# Altium project LuminOX to SDI-12 Interface.PrjPcb
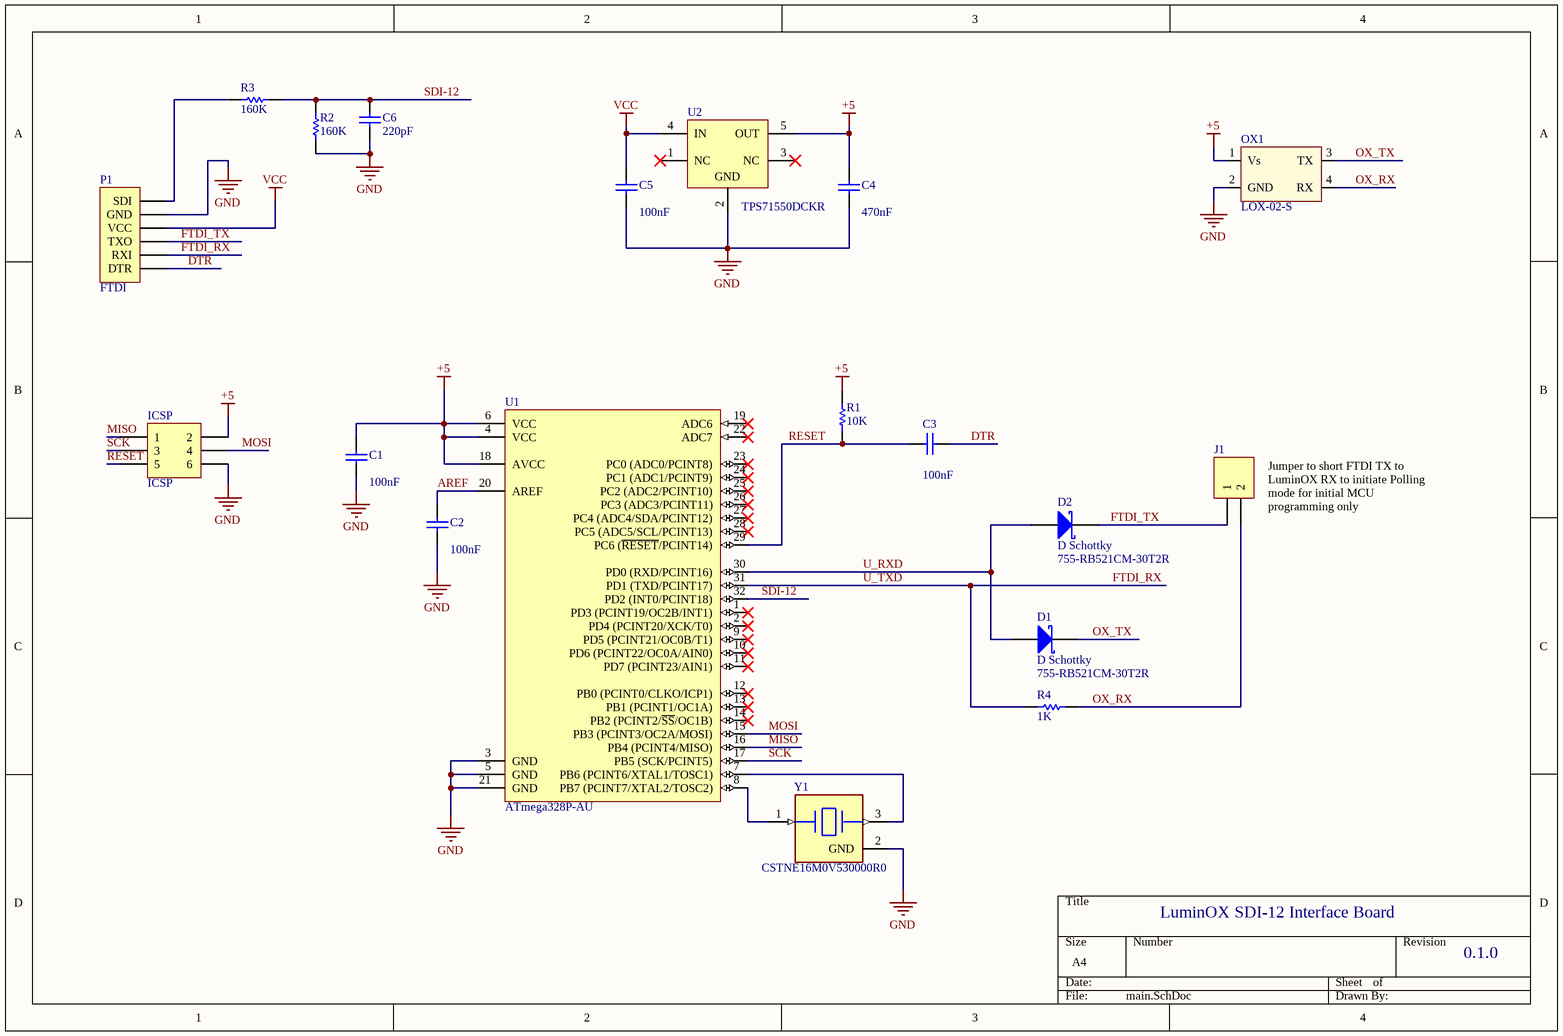
[diagram p0: main.SchDoc]
_version_major: 0; _version_minor: 1; _version_patch: 0
1 sheet, 19 parts. Net scope: global (net labels, ports and power ports of the same name join across sheets).
Board file: main.PcbDoc

## Sheet main.SchDoc
size A4; SheetNumber: 1; SheetTotal: 1

### Parts
C1  100nF  [C0402_CAPC1005X06N]
C2  100nF  [C0402_CAPC1005X06N]
C3  100nF  [C0402_CAPC1005X06N]
C4  470nF  [C0402_CAPC1005X06N]
C5  100nF  [C0402_CAPC1005X06N]
C6  220pF  [C0402_CAPC1005X06N]
D1  D Schottky  Supplier Part Number 1: 755-RB521CM-30T2R  [SOD923_SODFL98X40-2N]
D2  D Schottky  Supplier Part Number 1: 755-RB521CM-30T2R  [SOD923_SODFL98X40-2N]
ICSP  ICSP  [HDR2X3]
J1  (no value)  [HDR1X2]
OX1  LOX-02-S  [LOX-02-S]
P1  FTDI  [HDR1X6]
R1  10K  [R0402-RESC1005X04N]
R2  160K  [R0402-RESC1005X04N]
R3  160K  [R0402-RESC1005X04N]
R4  1K  [R0402-RESC1005X04N]
U1  ATmega328P-AU  [32A_M]
U2  TPS71550DCKR  [DCK0005A_N]
Y1  CSTNE16M0V530000R0  [FP-CSTNE16M0V530000R0-MFG]

### Nets
+5: C1.2 C4.2 ICSP.2 OX1.1(Vs) R1.2 U1.4(VCC) U1.6(VCC) U1.18(AVCC) U2.5(OUT)
GND: C1.1 C2.1 C4.1 C5.1 C6.2 ICSP.6 OX1.2(GND) P1.2(GND) R2.1 U1.3(GND) U1.5(GND) U1.21(GND) U2.2(GND) Y1.2(GND)
VCC: C5.2 P1.3(VCC) U2.4(IN)
AREF: C2.2 U1.20(AREF)
DTR: C3.1 P1.6(DTR)
FTDI_RX: P1.5(RXI) R4.1 U1.31(PD1_(TXD/PCINT17))  [also labelled U_TXD]
FTDI_TX: D2.2(K) J1.1 P1.4(TXO)
MISO: ICSP.1 U1.16(PB4_(PCINT4/MISO))
MOSI: ICSP.4 U1.15(PB3_(PCINT3/OC2A/MOSI))
OX_RX: J1.2 OX1.4(RX) R4.2
OX_TX: D1.2(K) OX1.3(TX)
RESET: C3.2 ICSP.5 R1.1 U1.29(PC6_(~{RESET}/PCINT14))
SCK: ICSP.3 U1.17(PB5_(SCK/PCINT5))
SDI-12: C6.1 R2.2 R3.1 U1.32(PD2_(INT0/PCINT18))
U_RXD: D1.1(A) D2.1(A) U1.30(PD0_(RXD/PCINT16))
NetP1_1: P1.1(SDI) R3.2
NetU1_7: U1.7(PB6_(PCINT6/XTAL1/TOSC1)) Y1.3(Output)
NetU1_8: U1.8(PB7_(PCINT7/XTAL2/TOSC2)) Y1.1(Input)

Not connected (* = marked no-connect by the designer): U1 1(PD3_(PCINT19/OC2B/INT1))* 2(PD4_(PCINT20/XCK/T0))* 9(PD5_(PCINT21/OC0B/T1))* 10(PD6_(PCINT22/OC0A/AIN0))* 11(PD7_(PCINT23/AIN1))* 12(PB0_(PCINT0/CLKO/ICP1))* 13(PB1_(PCINT1/OC1A))* 14(PB2_(PCINT2/~{SS}/OC1B))* 19(ADC6)* 22(ADC7)* 23(PC0_(ADC0/PCINT8))* 24(PC1_(ADC1/PCINT9))* 25(PC2_(ADC2/PCINT10))* 26(PC3_(ADC3/PCINT11))* 27(PC4_(ADC4/SDA/PCINT12))* 28(PC5_(ADC5/SCL/PCINT13))*; U2 1(NC)* 3(NC)*

### Notes on the sheet
- (near J1) Jumper to short FTDI TX to LuminOX RX to initiate Polling mode for initial MCU programming only
- LuminOX SDI-12 Interface Board

### Library data of the parts
C1-C6 = Cap Semi: Capacitor (Semiconductor SIM Model); Published: 8-Jun-2000; LatestRevisionDate: 29-May-2009; LatestRevisionNote: IPC-7351 Footprint Added.; PackageReference: C1206; Publisher: Altium Limited; PackageDescription: Chip Capacitor
  C1-C3 C5: Value: 100nF
  C4: Value: 470nF
  C6: Value: 220pF
D1 D2 = D Schottky: DIODESCHOTTKY30V100MAVMN2M; Manufacturer: Rohm; Manufacturer Part Number: RB521CM-30T2R; Average Rectified Current: 100mA; Max Reverse Voltage (DC): 30V; Published: 8-Jun-2000; LatestRevisionDate: 17-Jul-2002; LatestRevisionNote: Re-released for DXP Platform.; PackageReference: SMB; Publisher: Altium Limited; PackageDescription: DO-214-AA/SMB; 2 C-Bend Leads; Body 5.3 x 3.6 mm, inc. leads (LxW); Code_JEDEC: DO-214-AA; Supplier 1: Mouser; RoHS: Yes; Category: Rectifier Diodes; Stock 1: 103883; Pricing 1: 1=0.2, 10=0.143, 50=0.143, 100=0.087, 1000=0.062, 10000=0.04 (USD); Mount: Surface Mount; Case/Package: SMD/SMT; Number of Pins: 2; Packaging: Cut Tape; Series: -; RoHS Compliant: Yes; ComponentLink1URL: http://www.mouser.com/ds/2/348/rb521cm-30-e-907574.pdf?src-supplier=Mouser; ComponentLink1Description: http://www.mouser.com/ds/2/348/rb521cm-30-e-907574.pdf?src-supplier=Mouser; ComponentLink2URL: http://www.farnell.com/datasheets/2644371.pdf?src-supplier=Farnell; ComponentLink2Description: http://www.farnell.com/datasheets/2644371.pdf?src-supplier=Farnell; ComponentLink3URL: http://www.rohm.com/web/global/datasheet/RB521CM-30/rb521cm-30t2r-e?src-supplier=Digikey; ComponentLink3Description: http://www.rohm.com/web/global/datasheet/RB521CM-30/rb521cm-30t2r-e?src-supplier=Digikey; ComponentLink4URL: http://www.farnell.com/datasheets/2644371.pdf?src-supplier=Newark; ComponentLink4Description: http://www.farnell.com/datasheets/2644371.pdf?src-supplier=Newark; ComponentLink5URL: https://www.rohm.com/datasheet/RB521CM-30/rb521cm-30t2r-e?src-supplier=Digikey; ComponentLink5Description: https://www.rohm.com/datasheet/RB521CM-30/rb521cm-30t2r-e?src-supplier=Digikey
ICSP = Header 3X2: Header, 3-Pin, Dual row; LatestRevisionDate: 17-Jul-2002; LatestRevisionNote: Re-released for DXP Platform.; Publisher: Altium Limited
J1 = Header 2: Jumper to short FTDI TX to LuminOX RX to initiate Polling mode for initial MCU programming; LatestRevisionDate: 17-Jul-2002; LatestRevisionNote: Re-released for DXP Platform.; Publisher: Altium Limited
OX1 = LOX-02-S: LuminOx optical oxygen sensor; range: 25%; supply: 4.5-5.5VDC; working temperature: -30+60 deg.C; response time: 30s;...; Manufacturer: SST Sensing; Supplier 1: Mouser; Manufacturer Part Number: LOX-02-S; Stock 1: 5; Pricing 1: 1=138.36, 10=120.95, 50=115.92, 100=115.92, 1000=115.92, 10000=115.92 (USD)
P1 = Header 6: Header, 6-Pin; LatestRevisionDate: 17-Jul-2002; LatestRevisionNote: Re-released for DXP Platform.; Publisher: Altium Limited
R1-R4 = Res Semi: Semiconductor Resistor; Published: 8-Jun-2000; LatestRevisionDate: 17-Jul-2002; LatestRevisionNote: Re-released for DXP Platform.; PackageReference: AXIAL-0.5; Publisher: Altium Limited; PackageDescription: Axial Device, Thru-Hole; 2 Leads; 0.5 in Pin Spacing
  R1: Value: 10K
  R2 R3: Value: 160K
  R4: Value: 1K
U1 = CMP-0095-00269-2: 8-bit AVR Microcontroller, 32KB Flash, 1KB EEPROM, 2KB SRAM, 32-pin TQFP, Industrial Grade (-40°C to 85°C); PackageDescription: 32-Lead, 7x7x1.0 mm Body, 0.8mm Lead Pitch, Thin Profile Plastic Quad Flat Package (TQFP); DatasheetVersion: revD, May-2011; RevisionNote: DatasheetVersion & PackageVersion updated. URLs added.; ComponentLink1URL: http://www.atmel.com/; ComponentLink2Description: ATmega48A/48PA/88A/88PA/168A/168PA/328/328P Datasheet; Code_JEDEC: MS-026-ABA; ComponentLink1Description: Manufacturer URL; PackageReference: 32A; ComponentLink3Description: ATmega48A/48PA/88A/88PA/168A/168PA/328/328P Summary; ComponentLink2URL: http://www.atmel.com/dyn/resources/prod_documents/doc8271.pdf; PackageVersion: revC, Oct-2010; ComponentLink3URL: http://www.atmel.com/dyn/resources/prod_documents/8271S.pdf
U2 = CMP-0394-00921-2: Single Output LDO, 50 mA, Fixed 5 V Output, 3 to 24 V Input, 5-pin SC70 (DCK), -40 to 85 degC, Green (RoHS & no Sb/Br); Manufacturer: Texas Instruments; Iq(Typ)(mA): 0.003; Vout Adj(Min)(V): 5; SubFamily: Single Channel LDO; Vin(Min)(V): 3; Iout(Max)(A): 0.05; Vdo(Typ)(mV): 415; Accuracy(%): 4; Vin(Max)(V): 24; PartNumber: TPS71550DCKR; Eco-Plan: Green (RoHS & no Sb/Br); ComponentLink1URL: http://www.ti.com/; PackageDescription: 5-Pin Plastic Small-Outline, Body 2 x 1.25 mm, Pitch 0.65 mm; ComponentLink3URL: http://www.ti.com/litv/pdf/mpds025f; Mounting Technology: Surface Mount; ComponentLink3Description: Package Specification; PackageVersion: 4093553-3/G; Vout Adj(Max)(V): 5; ComponentLink2URL: http://www.ti.com/general/docs/lit/getliterature.tsp?genericPartNumber=TPS71550&fileType=pdf; DatasheetVersion: SLVS338P; ComponentLink2Description: Datasheet; Code_JEDEC: MO-203; ComponentLink1Description: Manufacturer URL; PackageReference: DCK0005A; Fixed Output Options(V): 5
Y1 = CMP-06054-000001-1: CERAMIC RES 16.0000MHZ 15PF SMD; Manufacturer: Murata; Tolerance: 0.5%; Stability: 0.3%; Frequency: 16MHz; Esr: 40Ω; Lead Free: Yes; ComponentLink2URL: https://www.murata.com/en-sg/products/productdata/8801162231838/SPEC-CSTNE16M0V530000R0.pdf?1545967809000; ComponentLink2Description: Datasheet; Device Class L3: Crystals; Load Capacitance: 15pF; Temperature: -40°C to +85°C; Temperature Range High: +85°C; Series: CSTNE_V; Mouser Description: Ceramic Resonator 16MHz ±0.5% (Tol) ±0.3% (Stability) 15pF 40Ohm 3-Pin CSMD T/R; Automotive: No; RoHS: TRUE; Device Class L2: Crystals / Oscillators; Manufacturer Part Number: CSTNE16M0V530000R0; Package: 0; Category: Crys; Device Class L1: Passive Components; Height: 1mm; Temperature Range Low: -40°C; Digikey Description: CERAMIC RES 16.0000MHZ 15PF SMD; Octopart: https://octopart.com/cstne16m0v530000r0-murata-91406924